# EAGLE design JDY08_CC2541_Breakout (EAGLE 7.6.0)
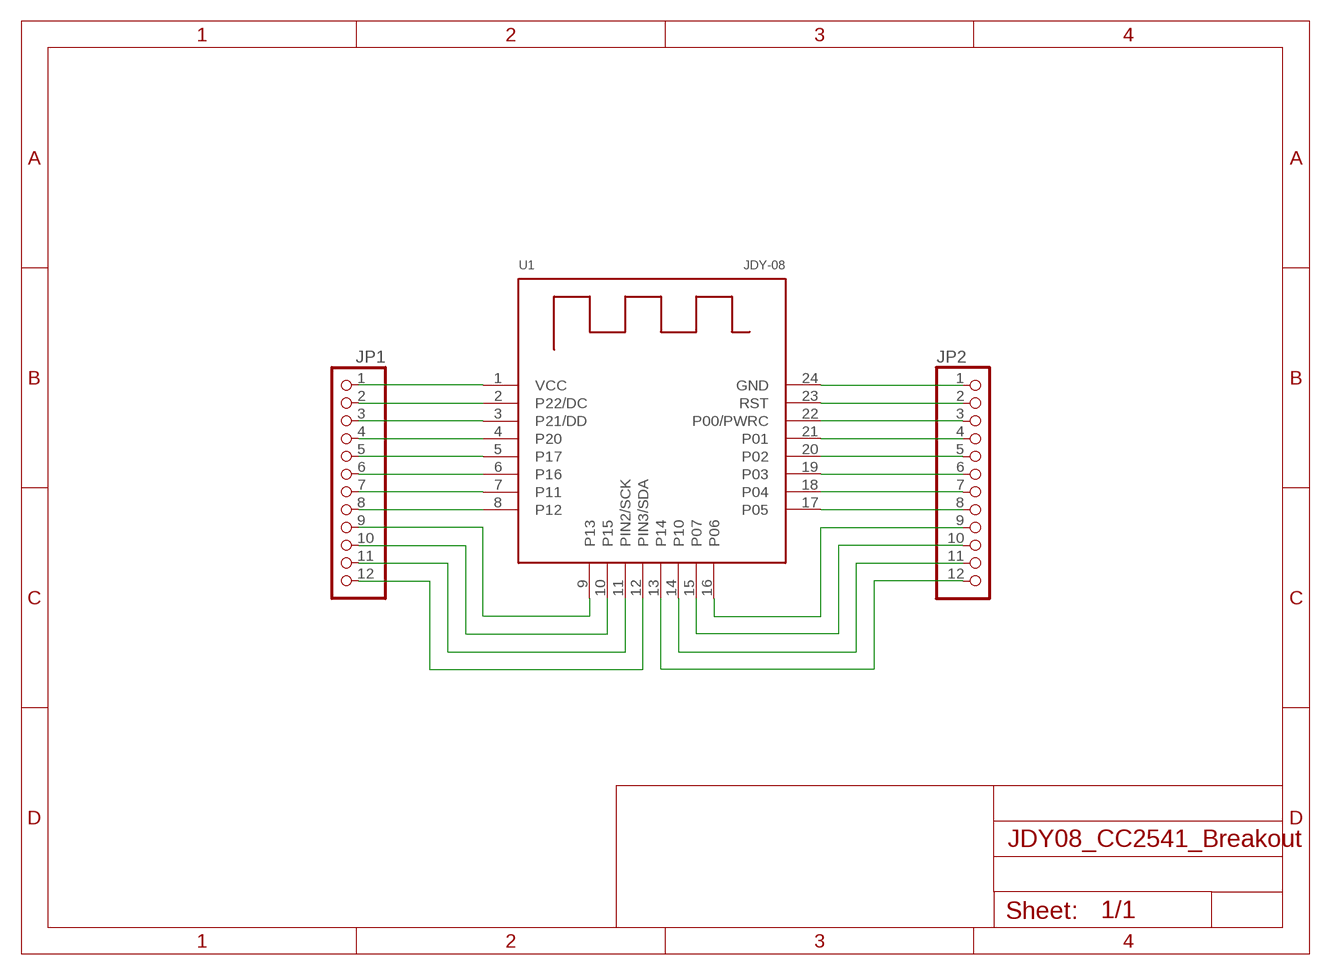
[diagram p0: schematic, sheet 1]

## Parts
JP1  HEADER-1X1276MIL  [1X12_ROUND_76MIL]
JP2  HEADER-1X1276MIL  [1X12_ROUND_76MIL]
U1  JDY-08  [JDY-08]

## Nets
N$1: JP1.1 U1.1(VCC)
N$2: JP1.2 U1.2(P22/DC)
N$3: JP1.3 U1.3(P21/DD)
N$4: JP1.4 U1.4(P20)
N$5: JP1.5 U1.5(P17)
N$6: JP1.6 U1.6(P16)
N$7: JP1.7 U1.7(P11)
N$8: JP1.8 U1.8(P12)
N$9: JP2.1 U1.24(GND)
N$10: JP2.2 U1.23(RST)
N$11: JP2.3 U1.22(P00/PWRC)
N$12: JP2.4 U1.21(P01)
N$13: JP2.5 U1.20(P02)
N$14: JP2.6 U1.19(P03)
N$15: JP2.7 U1.18(P04)
N$16: JP2.8 U1.17(P05)
N$17: JP1.9 U1.9(P13)
N$18: JP1.10 U1.10(P15)
N$19: JP1.11 U1.11(PIN2/SCK)
N$20: JP1.12 U1.12(PIN3/SDA)
N$21: JP2.9 U1.16(P06)
N$22: JP2.10 U1.15(P07)
N$23: JP2.11 U1.14(P10)
N$24: JP2.12 U1.13(P14)

## Library data of the parts
JP1 JP2 = microbuilder:HEADER-1X12
U1 = #afb-Boards:JDY-08: Bluetooth BLE 4.0 CC2541 Module

## Board
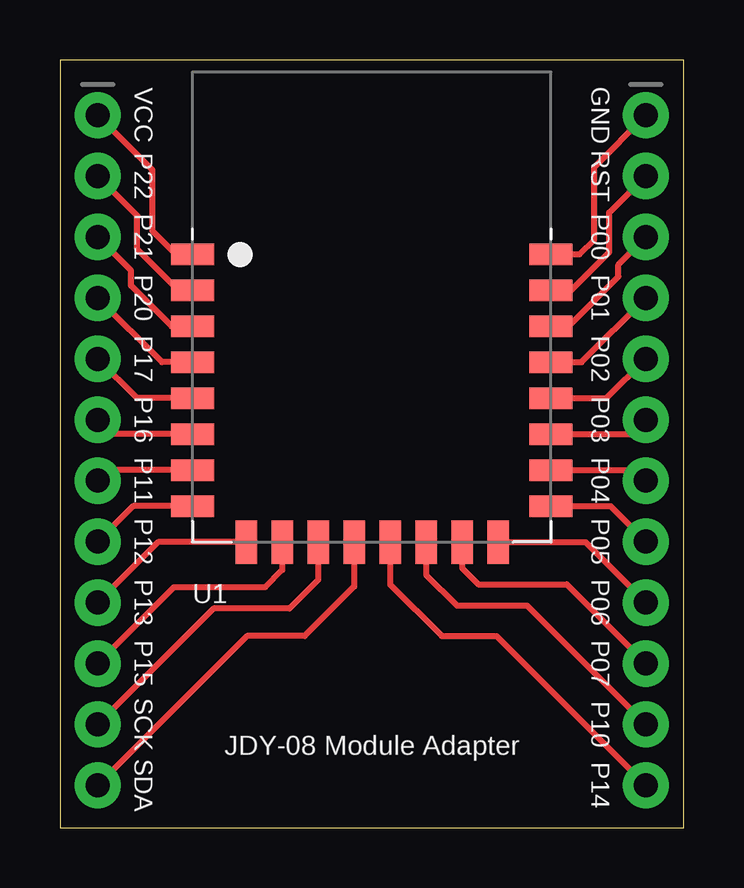
[diagram p1: board, top side]

Size 26 x 32 mm. Coordinates in mm from the lower left corner, seen from the top.
Outline: 0,0 26,0 26,32 0,32 0,0
Copper layers (1*16): Top 0.035mm / dielectric 1.6mm / Bottom 0.035mm
Design rules "Elecrow_2-layer_PCB_eagle_rule": minimum track width 6mil, minimum drill 12mil, track to track 6mil, track to pad 6mil, pad to pad 6mil, via to via 8mil, smd to smd 0mil, copper to edge 20mil, drill to drill 10mil, minimum pad ring 6mil, minimum via ring 6mil, stop-mask expansion 0mil, vias tented up to drill 100mil, thermal gap 10mil

### Footprints (pad centres in the part's own frame; a part is rotated, then mirrored left to right if it is on the bottom)
1X12_ROUND_76MIL = drill 1 pad 1.93: 1 -13.97,0; 2 -11.43,0; 3 -8.89,0; 4 -6.35,0; 5 -3.81,0; 6 -1.27,0; 7 1.27,0; 8 3.81,0; 9 6.35,0; 10 8.89,0; 11 11.43,0; 12 13.97,0
JDY-08 = smd 1.8 x 0.9: 1 -7.47,2.2; 2 -7.47,0.7; 3 -7.47,-0.8; 4 -7.47,-2.3; 5 -7.47,-3.8; 6 -7.47,-5.3; 7 -7.47,-6.8; 8 -7.47,-8.3; 17 7.47,-8.3; 18 7.47,-6.8; 19 7.47,-5.3; 20 7.47,-3.8; 21 7.47,-2.3; 22 7.47,-0.8; 23 7.47,0.7; 24 7.47,2.2 | smd 0.9 x 1.8: 9 -5.23,-9.8; 10 -3.73,-9.8; 11 -2.23,-9.8; 12 -0.73,-9.8; 13 0.77,-9.8; 14 2.27,-9.8; 15 3.77,-9.8; 16 5.27,-9.8

### Placement (x,y rotation side)
JP1  1.57,15.73 270 top
JP2  24.43,15.73 270 top
U1  13,21.7 0 top

### Tracks (layer width: path | path; a pad name or v marks a point on that pad's centre or on a via)
N$1
  Top 0.254: U1.1 4.83,23.9 3.86,24.87 3.86,27.41 JP1.1
N$2
  Top 0.254: U1.2 4.93,22.4 3.22,24.11 3.22,25.51 JP1.2
N$3
  Top 0.254: U1.3 4.66,20.9 2.97,22.59 2.97,23.22 JP1.3
N$4
  Top 0.254: U1.4 4.25,19.4 JP1.4
N$5
  Top 0.254: U1.5 3.21,17.9 JP1.5
N$6
  Top 0.254: U1.6 2.17,16.4 JP1.6
N$7
  Top 0.254: U1.7 2.01,14.9 JP1.7
N$8
  Top 0.254: U1.8 3.05,13.4 JP1.8
N$9
  Top 0.254: U1.24 21.68,23.9 22.27,24.49 22.27,27.54 JP2.1
N$10
  Top 0.254: U1.23 21.32,22.4 22.91,23.98 22.91,25.64 JP2.2
N$11
  Top 0.254: U1.22 21.22,20.9 23.29,22.97 23.29,23.48 JP2.3
N$12
  Top 0.254: U1.21 21.75,19.4 JP2.4
N$13
  Top 0.254: U1.20 22.79,17.9 JP2.5
N$14
  Top 0.254: U1.19 23.83,16.4 JP2.6
N$15
  Top 0.254: U1.18 23.99,14.9 JP2.7
N$16
  Top 0.254: U1.17 22.95,13.4 JP2.8
N$17
  Top 0.254: U1.9 4.09,11.9 JP1.9
N$18
  Top 0.254: U1.10 9.27,10.73 8.55,10.02 4.74,10.02 JP1.10
N$19
  Top 0.254: U1.11 10.77,10.32 9.57,9.13 6.4,9.13 JP1.11
N$20
  Top 0.254: U1.12 12.27,10.05 10.21,7.98 7.79,7.98 JP1.12
N$21
  Top 0.254: U1.16 21.91,11.9 JP2.9
N$22
  Top 0.254: U1.15 16.77,10.82 17.45,10.14 21.13,10.14 JP2.10
N$23
  Top 0.254: U1.14 15.27,10.54 16.56,9.25 19.48,9.25 JP2.11
N$24
  Top 0.254: U1.13 13.77,10.13 15.92,7.98 18.21,7.98 JP2.12

### Text on the board
tNames: VCC | GND | P22 | RST | P21 | P00 | P20 | P01 | P17 | P02 | P16 | P03 | P11 | P04 | P12 | P05 | P13 | P06 | P15 | P07 | SCK | P10 | JDY-08 Module Adapter | SDA | P14